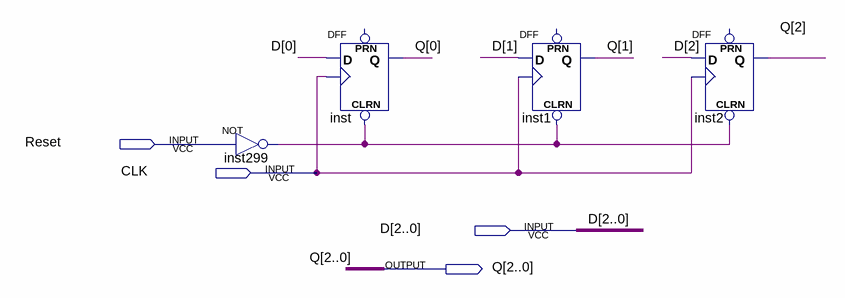
[diagram p0: schematic sheet]
// Quartus schematic Current_State.bdf as structural Verilog: 4 symbols, 4 pins
module Current_State (
  input  Reset,
  input  CLK,
  input  [2:0] D,
  output [2:0] Q
);

  wire inst299_out;

  not inst299 (inst299_out, Reset);
  DFF inst (.CLRN(inst299_out), .CLK(CLK), .D(D[0]), .Q(Q[0]));  // open: PRN
  DFF inst1 (.CLRN(inst299_out), .CLK(CLK), .D(D[1]), .Q(Q[1]));  // open: PRN
  DFF inst2 (.CLRN(inst299_out), .CLK(CLK), .D(D[2]), .Q(Q[2]));  // open: PRN
endmodule
